# EAGLE schematic USB-UART-Board-CP2102N v9 (EAGLE 9.7.0)
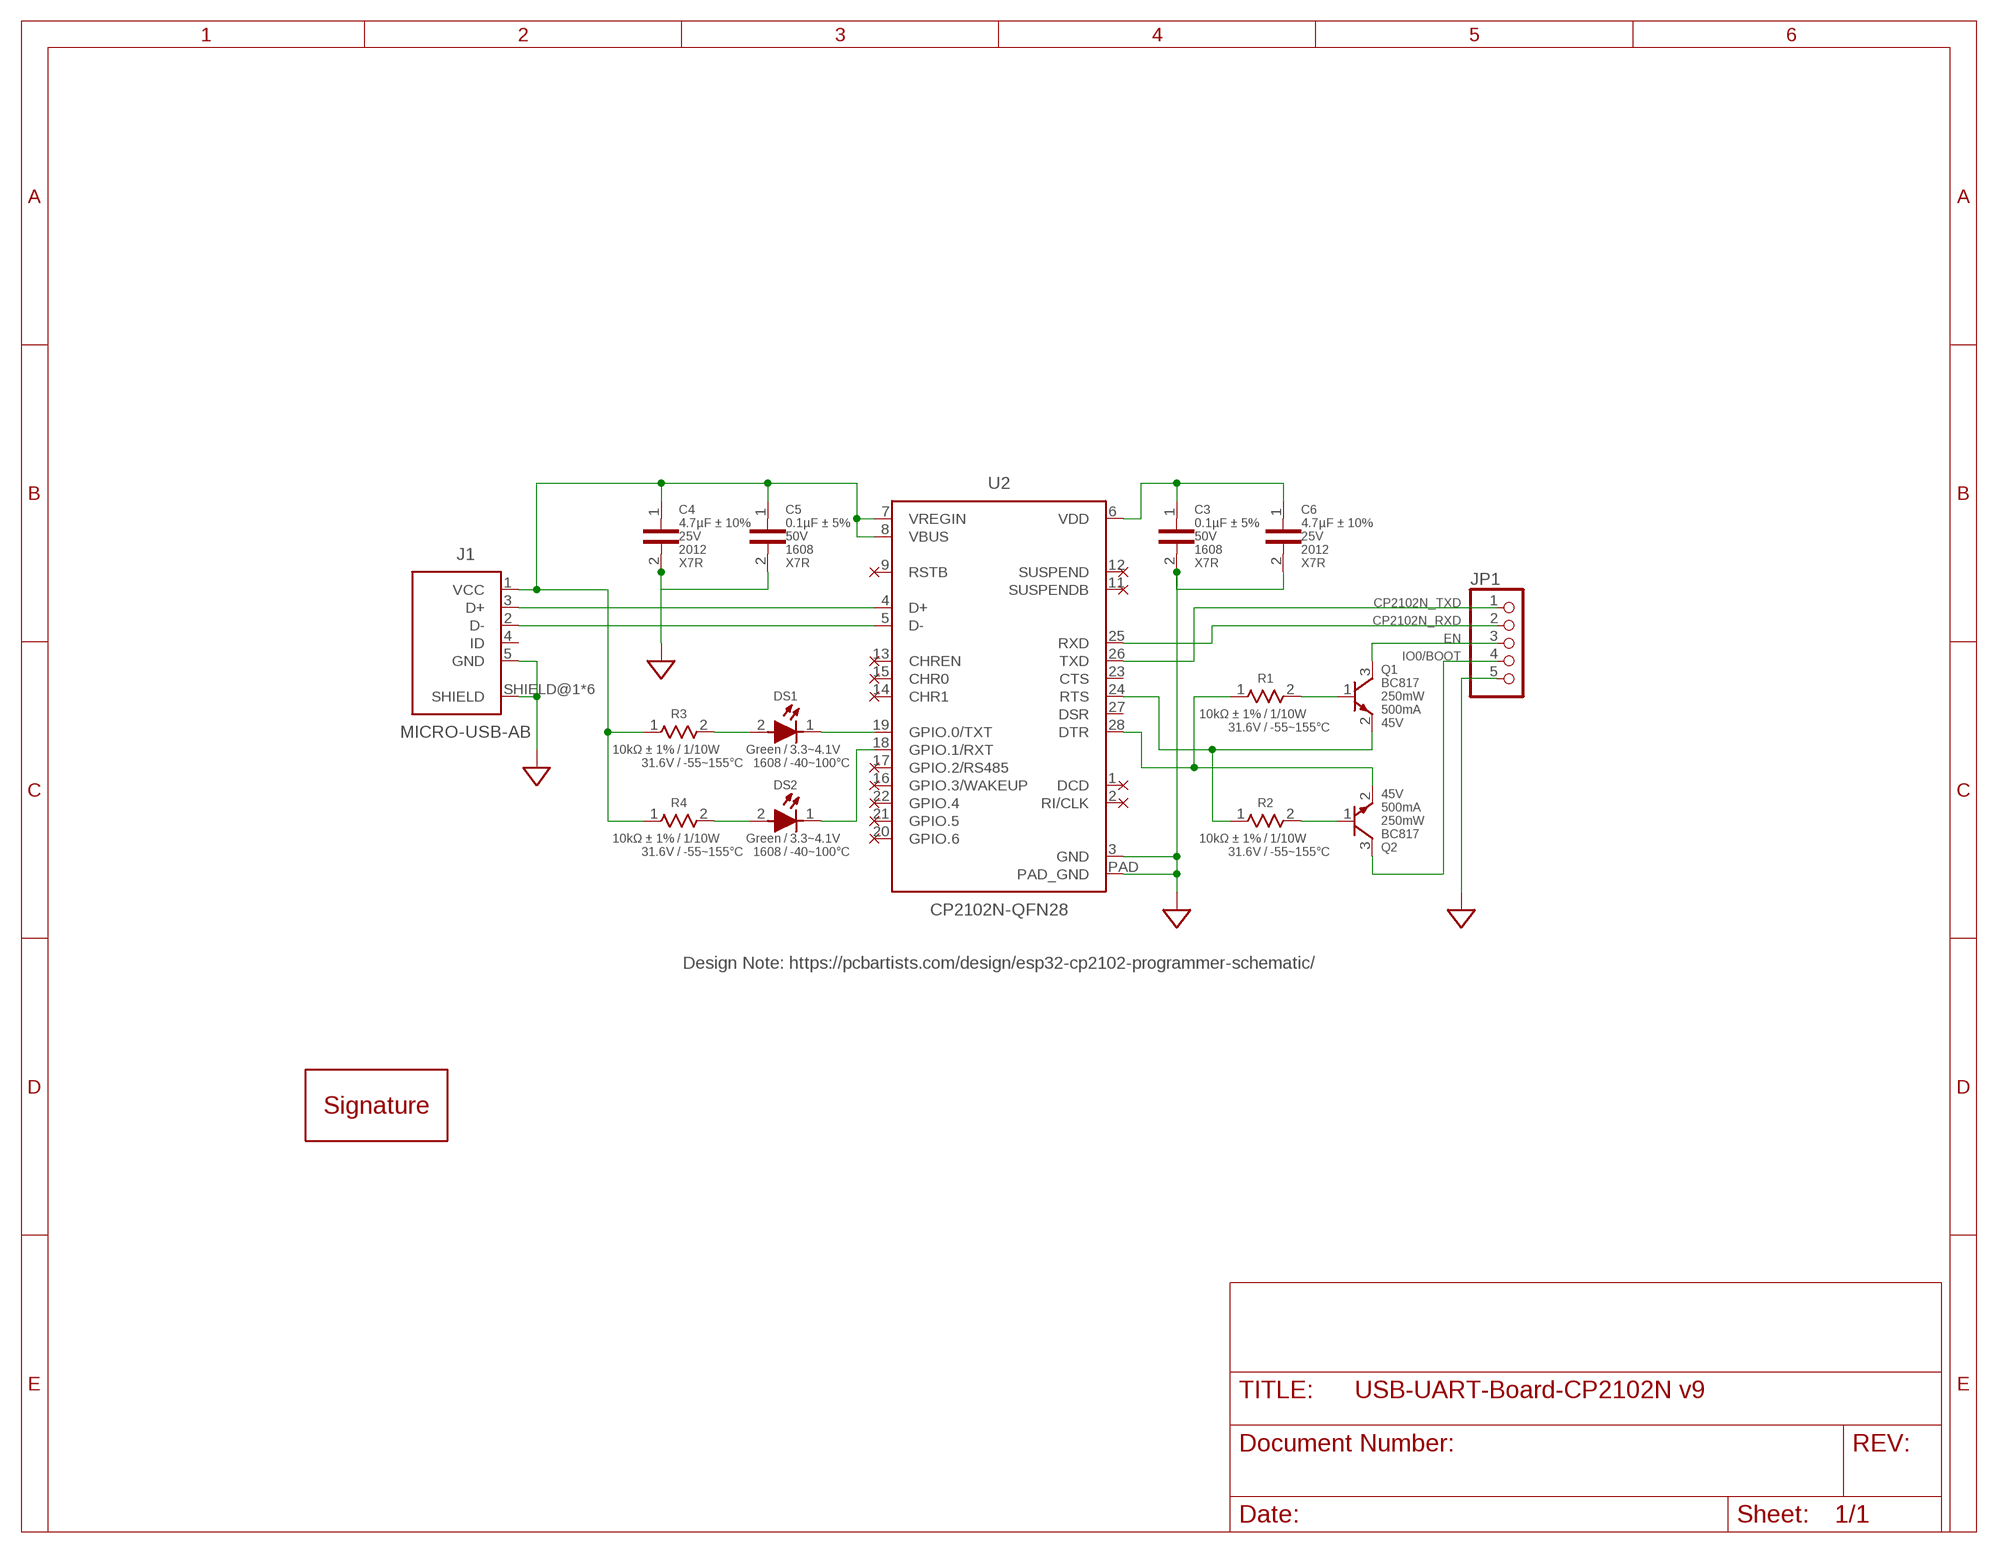
[diagram p0: schematic, sheet 1]

## Parts
C3  0.1µF ± 5%  CAP-V-0.1UF-1608  [1608-SEM]
C4  4.7µF ± 10%  CAP-V-4.7UF-2012  [2012-SEM]
C5  0.1µF ± 5%  CAP-V-0.1UF-1608  [1608-SEM]
C6  4.7µF ± 10%  CAP-V-4.7UF-2012  [2012-SEM]
DS1  Green  LED-H-GREEN-1608  [1608]
DS2  Green  LED-H-GREEN-1608  [1608]
J1  MICRO-USB-AB  [47589-0001]
JP1  PINHD-1X5  [1X05]
Q1  BC817  BJT-NPN-BC817  [SOT-23]
Q2  BC817  BJT-NPN-BC817  [SOT-23]
R1  10kΩ ± 1%  RES-H-10K-1608  [1608-SEM]
R2  10kΩ ± 1%  RES-H-10K-1608  [1608-SEM]
R3  10kΩ ± 1%  RES-H-10K-1608  [1608-SEM]
R4  10kΩ ± 1%  RES-H-10K-1608  [1608-SEM]
U2  CP2102N-QFN28  [QFN28]
U$2  SIGNATURE  [SIGNATURE]

## Nets
CP2102N_D+: J1.3(D+) U2.4(D+)
CP2102N_D-: J1.2(D-) U2.5(D-)
CP2102N_DTR: Q2.2(E) R1.1 U2.28(DTR)
CP2102N_RTS: Q1.2(E) R2.1 U2.24(RTS)
CP2102N_RXD: JP1.2 U2.25(RXD)
CP2102N_RXT: DS2.1 U2.18(GPIO.1/RXT)
CP2102N_TXD: JP1.1 U2.26(TXD)
CP2102N_TXT: DS1.1 U2.19(GPIO.0/TXT)
CP2102N_VBUS: C4.1 C5.1 J1.1(VCC) R3.1 R4.1 U2.7(VREGIN) U2.8(VBUS)
CP2102N_VDD: C3.1 C6.1 U2.6(VDD)
EN: JP1.3 Q1.3(C)
GND: C3.2 C4.2 C5.2 C6.2 J1.5(GND) J1.SHIELD@1(SHIELD) J1.SHIELD@2(SHIELD) J1.SHIELD@3(SHIELD) J1.SHIELD@4(SHIELD) J1.SHIELD@5(SHIELD) J1.SHIELD@6(SHIELD) JP1.5 U2.3(GND) U2.PAD(PAD_GND)
IO0/BOOT: JP1.4 Q2.3(C)
N$3: Q1.1(B) R1.2
N$4: Q2.1(B) R2.2
N$5: DS1.2 R3.2
N$6: DS2.2 R4.2
Unconnected: J1.4(ID) U2.1(DCD) U2.2(RI/CLK) U2.9(RSTB) U2.11(SUSPENDB) U2.12(SUSPEND) U2.13(CHREN) U2.14(CHR1) U2.15(CHR0) U2.16(GPIO.3/WAKEUP) U2.17(GPIO.2/RS485) U2.20(GPIO.6) U2.21(GPIO.5) U2.22(GPIO.4) U2.23(CTS) U2.27(DSR)

## Notes on the sheet
- Design Note: https://pcbartists.com/design/esp32-cp2102-programmer-schematic/

## Library data of the parts
C3 C5 = Harrington-Capacitors:CAP-V: Ceramic Capacitors - Vertical; SIZE: 1608; TEMPERATURE: X7R; VOLTAGE: 50V
C4 C6 = Harrington-Capacitors:CAP-V: Ceramic Capacitors - Vertical; SIZE: 2012; TEMPERATURE: X7R; VOLTAGE: 25V
DS1 DS2 = Harrington-Diodes:LED-H: LEDs Kingbright - Horizontal; SIZE: 1608; TEMPERATURE: -40~100°C; VOLTAGE: 3.3~4.1V
J1 = Harrington-Connectors:MICRO-USB-AB: Micro USB AB Molex
JP1 = pinhead:PINHD-1X5: PIN HEADER
Q1 Q2 = Harrington-Transistors:BJT-NPN: NPN BJTs; IC_MAX: 500mA; POWER: 250mW; VCE_MAX: 45V
R1-R4 = Harrington-Resistors:RES-H: Resistors - Horizontal; POWER: 1/10W; TEMPERATURE: -55~155°C; VOLTAGE: 31.6V
U2 = Harrington-ICs:CP2102N-QFN28: CP2102N QFN28 Silicon Labs - CP2102N 28 pin variant with TXT and RXT
U$2 = Harrington-Aesthetics:SIGNATURE: PCB Signature